# EAGLE design Viper0.4.1 tmd probe (6-12) (EAGLE 8.5.2)
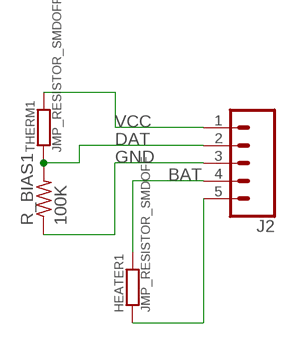
[diagram p0: schematic, sheet 1]

## Parts
HEATER1  JMP_RESISTOR_SMDOFF  [JMP_OFF_SMD]
J2  CONN_05NO_SILK  [1X05_NO_SILK]
R_BIAS1  100K  FLIPFLOP-RES  [0805-THM]
THERM1  JMP_RESISTOR_SMDOFF  [JMP_OFF_SMD]

## Nets
BAT: HEATER1.2 J2.4
DAT: J2.2 R_BIAS1.2 THERM1.1
GND: HEATER1.1 J2.3 J2.5 R_BIAS1.1
VCC: J2.1 THERM1.2

## Library data of the parts
HEATER1 THERM1 = brett:JMP_RESISTOR_SMD
J2 = SparkFun-Connectors:CONN_05: Multi connection point. Often used as Generic Header-pin footprint for 0.1 inch spaced/style header connections On any of the 0.1 inch spaced packages, you can populate with these: Break Away Headers - Straight <https://www.sparkfun.com/products/116> (PRT-00116) Break Away Male Headers - Right Angle <https://www.sparkfun.com/products/553> (PRT-00553) Female Headers <https://www.sparkfun.com/products/115> (PRT-00115) Break Away Headers - Machine Pin <https://www.sparkfun.com/products/117> (PRT-00117) Break Away Female Headers - Swiss Machine Pin <https://www.sparkfun.com/products/743> (PRT-00743) For SCREWTERMINALS and SPRING TERMINALS visit here: Screw Terimnals on SparkFun.com <https://www.sparkfun.com/search/results?term=Screw+Terminals> (5mm/3.5mm/2.54mm spacing) This device is also useful as a general connection point to wire up your design to another part of your project. Our various solder wires solder well into these plated through hole pads. Hook-Up Wire - Assortment (Stranded, 22 AWG) <https://www.sparkfun.com/products/11375> (PRT-11375) Hook-Up Wire - Assortment (Solid Core, 22 AWG) <https://www.sparkfun.com/products/11367> (PRT-11367) View the entire wire category on our website here <https://www.sparkfun.com/categories/141> Special notes: Molex polarized connector foot print use with SKU : PRT-08231 with associated crimp pins and housings. 1MM SMD Version SKU: PRT-10208
R_BIAS1 = adafruit:FLIPFLOP-RES: Flip Flop resistor An 0805 resistor inside a standard 1/4W 5% resistor. Makes for easy mods

## Board
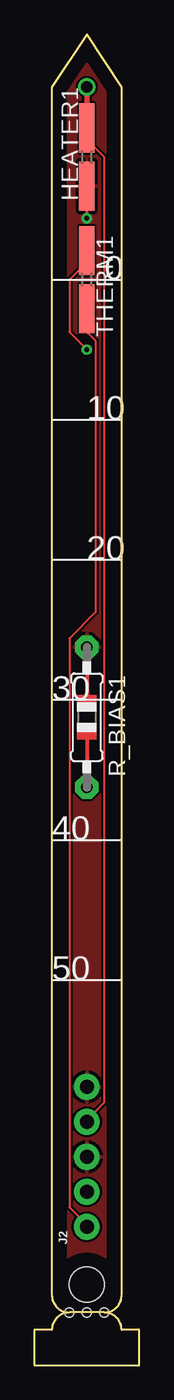
[diagram p1: board, top side]
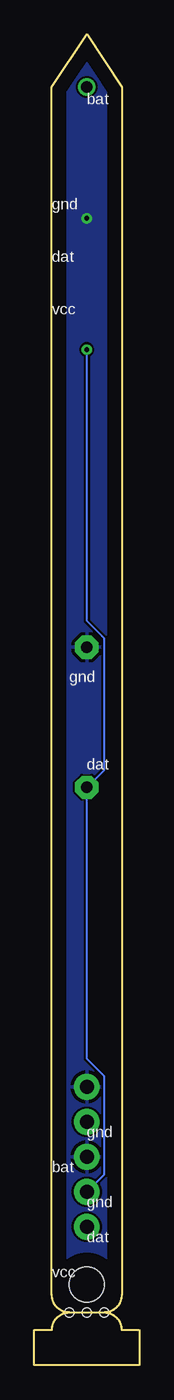
[diagram p2: board, bottom side, seen from below]

Size 7.62 x 96.52 mm. Coordinates in mm from the lower left corner, seen from the top.
Outline: 2.54,3.81 arc-90 1.27,5.08 1.27,92.71 3.81,96.52 6.35,92.71 6.35,5.08 arc-90 5.08,3.81
Outline: 2.54,3.81 arc90 1.27,2.54 0,2.54 0,0 7.62,0 7.62,2.54 6.35,2.54 arc90 5.08,3.81
Outline: 5.08,3.81 2.54,3.81
Copper layers (1*16): Top 0.035mm / dielectric 1.5mm / Bottom 0.035mm
Design rules "default": minimum track width 6mil, minimum drill 0.35mm, track to track 6mil, track to pad 6mil, pad to pad 6mil, via to via 6mil, smd to smd 6mil, copper to edge 40mil, drill to drill 6mil, minimum pad ring 10mil, minimum via ring 8mil, stop-mask expansion 4mil, vias tented up to drill 0mil, thermal gap 10mil
Holes 2.54 mm at 3.81,5.84
Holes 0.65 mm at 2.54,3.81 3.81,3.81 5.08,3.81

### Footprints (pad centres in the part's own frame; a part is rotated, then mirrored left to right if it is on the bottom)
JMP_OFF_SMD = smd 3.556 x 1.1: 1 -2.108,0; 2 2.108,0
1X05_NO_SILK = drill 1.016 pad 1.88: 1 0,0; 2 2.54,0; 3 5.08,0; 4 7.62,0; 5 10.16,0
0805-THM = drill 0.813 pad 1.676 octagon: 1 -5.08,0; 2 5.08,0

### Placement (x,y rotation side)
HEATER1  3.81,87.63 90 top
J2  3.81,10.03 90 top
R_BIAS1  3.81,46.99 270 top
THERM1  3.81,78.74 270 top

### Tracks (layer width: path | path; a pad name or v marks a point on that pad's centre or on a via)
BAT  (via drill 0.85)
  Top 0.152: HEATER1.2 3.81,88.9 5.08,87.63 5.08,19.05 3.81,17.78 J2.4
  Top 0.406: HEATER1.2 v3.81,92.71
DAT  (via drill 0.35)
  Top 0.152: v3.81,73.66 2.54,74.93 2.54,78.74 3.81,80.01 THERM1.1
  Bottom 0.152: v3.81,73.66 3.81,53.98 2.54,52.7 2.54,43.18 R_BIAS1.2 3.81,22.23 2.54,20.96 2.54,13.84 J2.2
GND  (via drill 0.35)
  Top 0.152: v3.81,83.19 HEATER1.1
  pour Bottom: 3.81,96.52 1.27,92.71 1.27,3.81 6.35,3.81 6.35,92.71
  pour Top: 3.81,96.52 1.27,92.71 1.27,3.81 6.35,3.81 6.35,92.71
VCC
  Top 0.152: J2.1 3.81,10.16 2.54,11.43 2.54,52.7 4.45,54.61 4.45,74.3 3.81,74.93 THERM1.2

### Text on the board
tPlace: 0 | 10 | 20 | 30 | 40 | 50
bPlace: bat | gnd | dat | vcc | gnd | dat | gnd | bat | gnd | dat | vcc